# EAGLE design M223B (EAGLE 6.6.0)
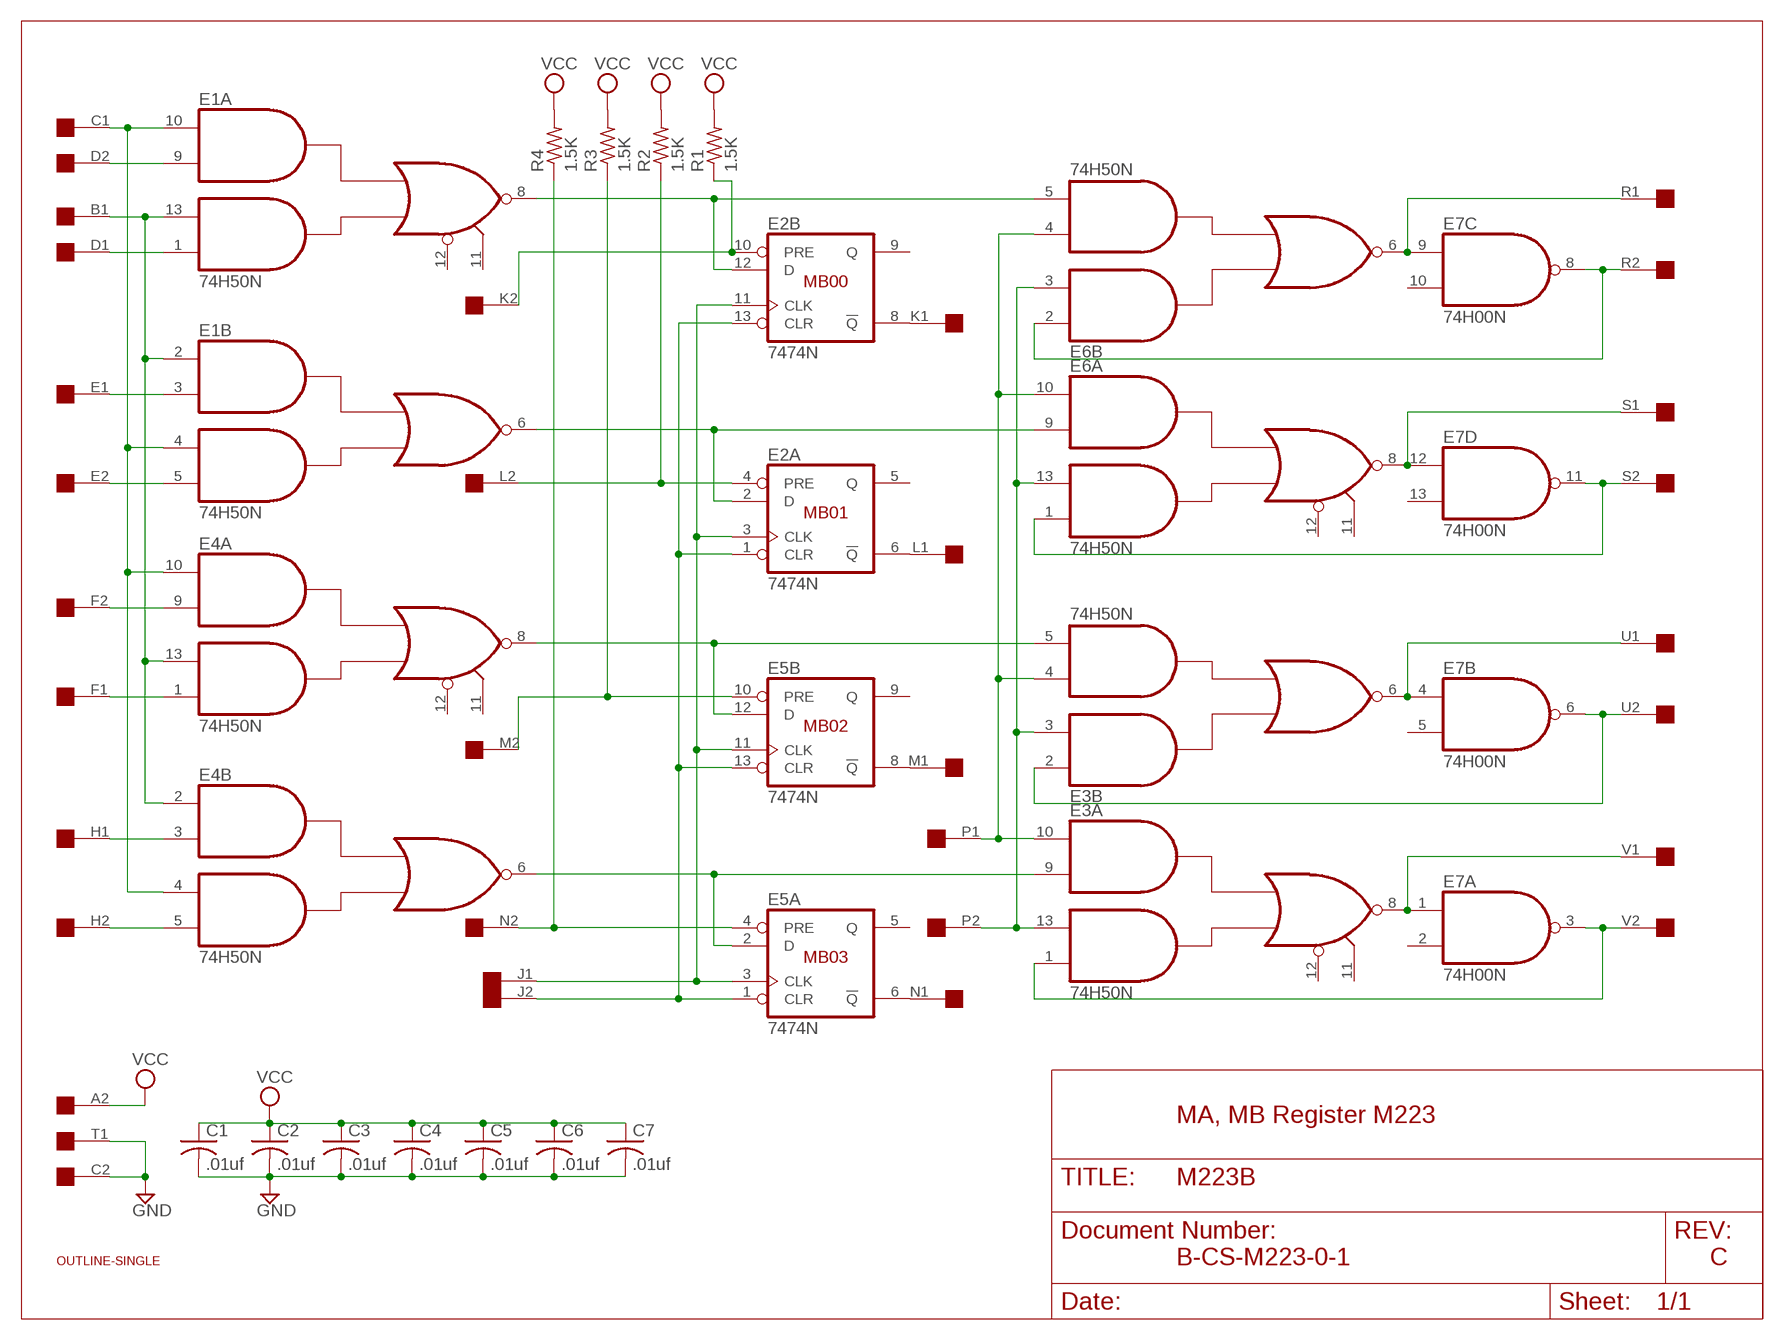
[diagram p0: schematic, sheet 1]

## Parts
C1  .01uf  C-US050-025X075  [C050-025X075]
C2  .01uf  C-US050-025X075  [C050-025X075]
C3  .01uf  C-US050-025X075  [C050-025X075]
C4  .01uf  C-US050-025X075  [C050-025X075]
C5  .01uf  C-US050-025X075  [C050-025X075]
C6  .01uf  C-US050-025X075  [C050-025X075]
C7  .01uf  C-US050-025X075  [C050-025X075]
E1  74H50N  7450N  [DIL14]
E2  7474N  74S74N  [DIL14]
E3  74H50N  7450N  [DIL14]
E4  74H50N  7450N  [DIL14]
E5  7474N  74S74N  [DIL14]
E6  74H50N  7450N  [DIL14]
E7  74H00N  7400N  [DIL14]
R1  1.5K  R-US_0207/10  [0207/10]
R2  1.5K  R-US_0207/10  [0207/10]
R3  1.5K  R-US_0207/10  [0207/10]
R4  1.5K  R-US_0207/10  [0207/10]
U$1  OUTLINE-SINGLE  [SINGLE]
U$4  SINGLE  [EDGE-CON2]

## Nets
GND [Supply]: C1.2 C2.2 C3.2 C4.2 C5.2 C6.2 C7.2 U$4.C2 U$4.T1
N$1: E1.6(B:O) E2.2(A:D) E6.9(A:I2)
N$2: E1.8(A:O) E2.12(B:D) E6.5(B:I4)
N$3: E3.8(A:O) E7.1(A:I0) U$4.V1
N$4: E1.1(A:I4) U$4.D1
N$5: E1.9(A:I2) U$4.D2
N$6: E1.2(B:I1) E1.13(A:I3) E4.2(B:I1) E4.13(A:I3) U$4.B1
N$7: E1.4(B:I3) E1.10(A:I1) E4.4(B:I3) E4.10(A:I1) U$4.C1
N$8: E1.3(B:I2) U$4.E1
N$9: E1.5(B:I4) U$4.E2
N$10: E4.1(A:I4) U$4.F1
N$11: E4.3(B:I2) U$4.H1
N$12: E4.9(A:I2) U$4.F2
N$13: E4.5(B:I4) U$4.H2
N$14: E3.5(B:I4) E4.8(A:O) E5.12(B:D)
N$15: E3.9(A:I2) E4.6(B:O) E5.2(A:D)
N$16: E3.6(B:O) E7.4(B:I0) U$4.U1
N$17: E6.8(A:O) E7.12(D:I0) U$4.S1
N$18: E6.6(B:O) E7.9(C:I0) U$4.R1
N$19: E2.8(B:!Q) U$4.K1
N$20: E2.6(A:!Q) U$4.L1
N$21: E5.8(B:!Q) U$4.M1
N$22: E5.6(A:!Q) U$4.N1
N$23: E2.3(A:CLK) E2.11(B:CLK) E5.3(A:CLK) E5.11(B:CLK) U$4.J1
N$24: E2.1(A:CLR) E2.13(B:CLR) E5.1(A:CLR) E5.13(B:CLR) U$4.J2
N$25: E2.10(B:PRE) R1.1 U$4.K2
N$26: E5.4(A:PRE) R4.1 U$4.N2
N$27: E5.10(B:PRE) R3.1 U$4.M2
N$28: E2.4(A:PRE) R2.1 U$4.L2
N$29: E3.3(B:I2) E3.13(A:I3) E6.3(B:I2) E6.13(A:I3) U$4.P2
N$30: E3.4(B:I3) E3.10(A:I1) E6.4(B:I3) E6.10(A:I1) U$4.P1
N$31: E3.1(A:I4) E7.3(A:O) U$4.V2
N$33: E3.2(B:I1) E7.6(B:O) U$4.U2
N$34: E6.1(A:I4) E7.11(D:O) U$4.S2
N$36: E6.2(B:I1) E7.8(C:O) U$4.R2
VCC [Supply]: C1.1 C2.1 C3.1 C4.1 C5.1 C6.1 C7.1 R1.2 R2.2 R3.2 R4.2 U$4.A2
Unconnected: E1.11(A:I6) E1.12(A:I5) E2.5(A:Q) E2.9(B:Q) E3.11(A:I6) E3.12(A:I5) E4.11(A:I6) E4.12(A:I5) E5.5(A:Q) E5.9(B:Q) E6.11(A:I6) E6.12(A:I5) E7.2(A:I1) E7.5(B:I1) E7.10(C:I1) E7.13(D:I1) U$4.A1 U$4.B2 U$4.T2

## Notes on the sheet
- MB00
- MB01
- MB02
- MB03
- MA, MB Register M223
- B-CS-M223-0-1 | C

## Power pins joined to a net without a drawn wire
GND: E1.7(P:GND) E2.7(P:GND) E3.7(P:GND) E4.7(P:GND) E5.7(P:GND) E6.7(P:GND) E7.7(P:GND)
VCC: E1.14(P:VCC) E2.14(P:VCC) E3.14(P:VCC) E4.14(P:VCC) E5.14(P:VCC) E6.14(P:VCC) E7.14(P:VCC)

## Library data of the parts
C1-C7 = rcl:C-US: CAPACITOR, American symbol
E1 E3 E4 E6 = dec-con:74*50: 4-2-3-2 input AND OR INVERTER gates
E2 E5 = 74xx-us:74*74: Dual D type positive edge triggered FLIP FLOP, preset and clear
E7 = 74xx-us:74*00: Quad 2-input NAND gate
R1-R4 = rcl:R-US_: RESISTOR, American symbol
U$1 = dec-con:OUTLINE-*: Board outlines for DEC boards.
U$4 = dec-con:SINGLE: Single-Height DEC board

## Net classes
1 Supply: width 0.813 mm

## Board
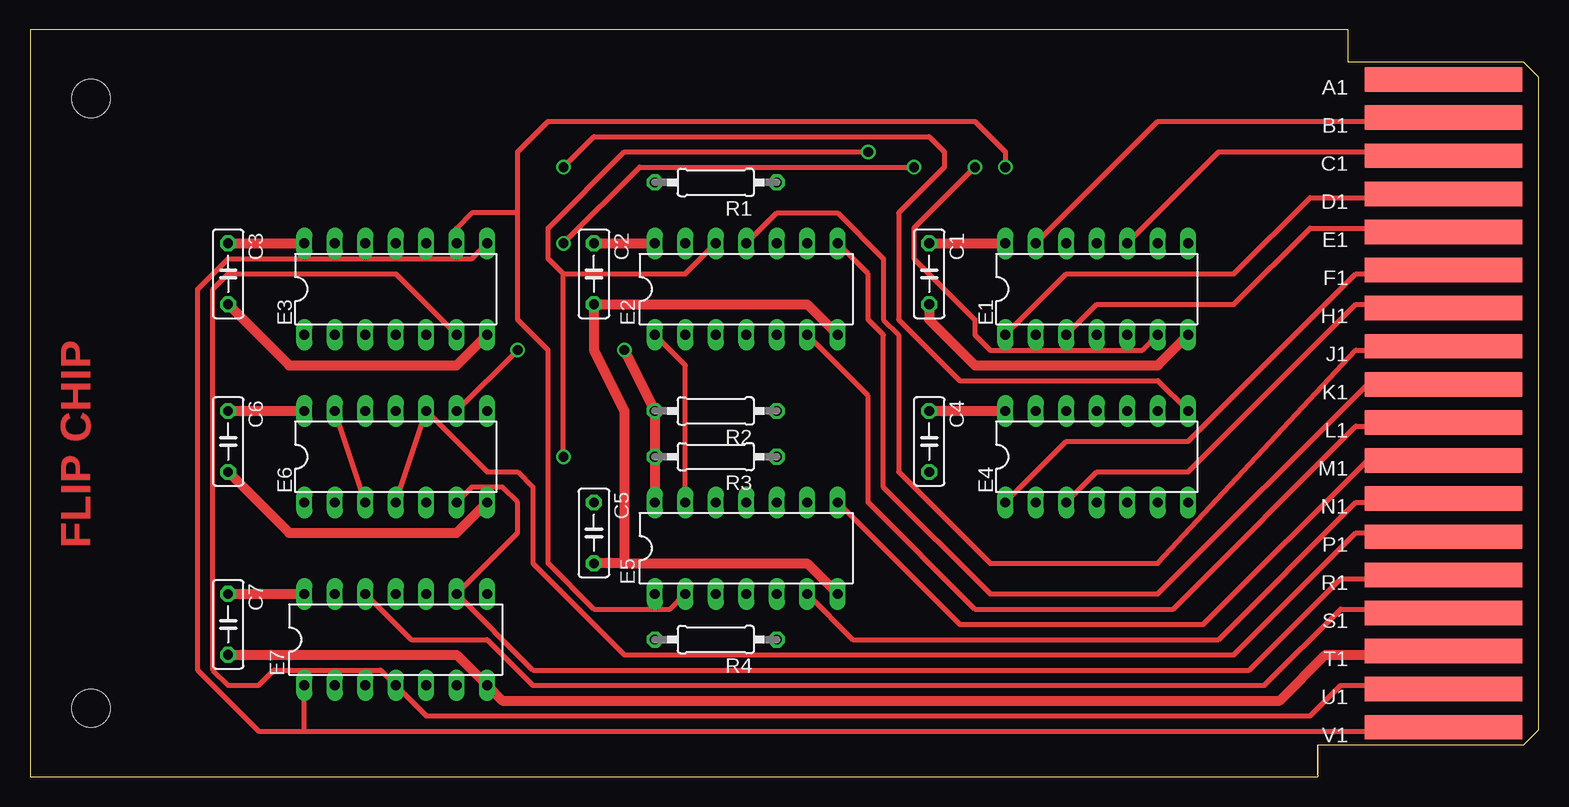
[diagram p1: board, top side]
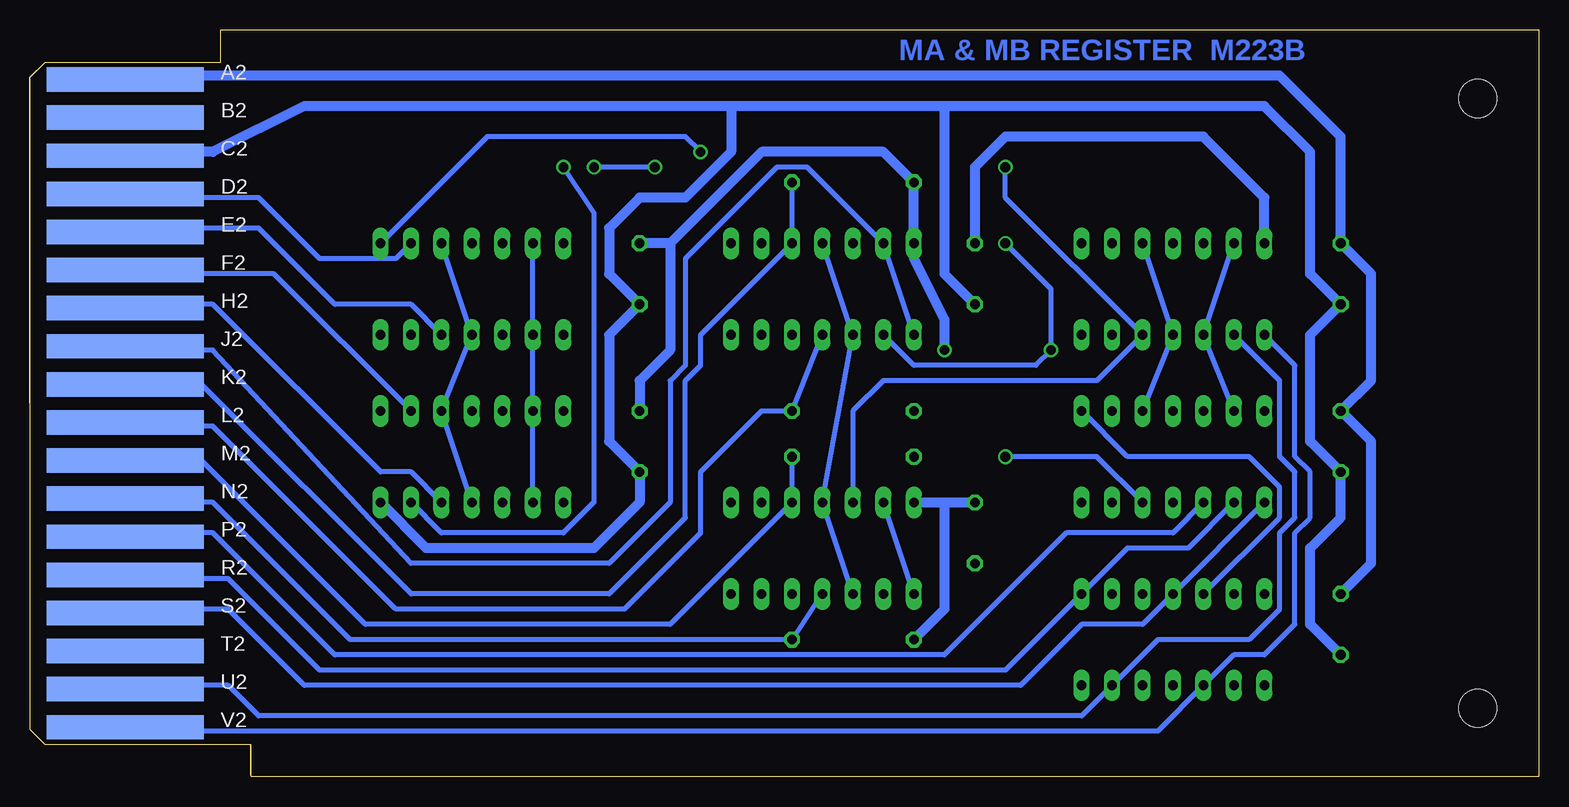
[diagram p2: board, bottom side, seen from below]

Size 125.73 x 62.23 mm. Coordinates in mm from the lower left corner, seen from the top.
Copper layers (1+16): Top 0.035mm / dielectric 1.5mm / Bottom 0.035mm
Design rules "16mils": minimum track width 16mil, minimum drill 32mil, track to track 15mil, track to pad 10mil, pad to pad 10mil, via to via 10mil, smd to smd 10mil, copper to edge 13mil, drill to drill 10mil, minimum pad ring 10mil, minimum via ring 8mil, stop-mask expansion 0mil, vias tented up to drill 0mil, thermal gap 10mil

### Footprints (pad centres in the part's own frame; a part is rotated, then mirrored left to right if it is on the bottom)
C050-025X075 = drill 0.813 octagon: 1 -2.54,0; 2 2.54,0
DIL14 = drill 0.813 long: 1 -7.62,-3.81; 2 -5.08,-3.81; 3 -2.54,-3.81; 4 0,-3.81; 5 2.54,-3.81; 6 5.08,-3.81; 7 7.62,-3.81; 8 7.62,3.81; 9 5.08,3.81; 10 2.54,3.81; 11 0,3.81; 12 -2.54,3.81; 13 -5.08,3.81; 14 -7.62,3.81
0207/10 = drill 0.813 octagon: 1 -5.08,0; 2 5.08,0
SINGLE = hole 3.175: 120.65,56.515; 120.65,5.715
EDGE-CON2 = smd 13.106 x 2.032: A1 7.938,4.128; B1 7.938,7.303; C1 7.938,10.477; D1 7.938,13.652; E1 7.938,16.828; F1 7.938,20.003; H1 7.938,23.177; J1 7.938,26.352; K1 7.938,29.527; L1 7.938,32.703; M1 7.938,35.877; N1 7.938,39.053; P1 7.938,42.227; R1 7.938,45.403; S1 7.938,48.578; T1 7.938,51.752; U1 7.938,54.928; V1 7.938,58.102 | smd 13.106 x 2.032 bottom: A2 7.938,4.128; B2 7.938,7.303; C2 7.938,10.477; D2 7.938,13.652; E2 7.938,16.828; F2 7.938,20.003; H2 7.938,23.177; J2 7.938,26.352; K2 7.938,29.527; L2 7.938,32.703; M2 7.938,35.877; N2 7.938,39.053; P2 7.938,42.227; R2 7.938,45.403; S2 7.938,48.578; T2 7.938,51.752; U2 7.938,54.928; V2 7.938,58.102

### Placement (x,y rotation side)
C1  74.93,41.91 270 top
C2  46.99,41.91 270 top
C3  16.51,41.91 270 top
C4  74.93,27.94 270 top
C5  46.99,20.32 270 top
C6  16.51,27.94 270 top
C7  16.51,12.7 270 top
E1  88.9,40.64 0 top
E2  59.69,40.64 0 top
E3  30.48,40.64 0 top
E4  88.9,26.67 0 top
E5  59.69,19.05 0 top
E6  30.48,26.67 0 top
E7  30.48,11.43 0 top
R1  57.15,49.53 180 top
R2  57.15,30.48 180 top
R3  57.15,26.67 180 top
R4  57.15,11.43 180 top
U$1  125.73,62.23 180 top
U$4  125.73,62.23 180 top
U$5  [FLIPCHIP]  0,0 0 top

### Tracks (layer width: path | path; a pad name or v marks a point on that pad's centre or on a via)
GND
  Top 0.813: 49.53,17.78 64.77,17.78 E5.7 | E2.7 64.77,39.37 C2.2 46.99,35.56 49.53,30.48 49.53,17.78 | E1.7 93.98,34.29 78.74,34.29 74.93,38.1 C1.2 | E3.7 35.56,34.29 21.59,34.29 C3.2 | U$4.T1 116.84,10.16 107.95,10.16 104.14,6.35 39.37,6.35 E7.7 35.56,10.16 C7.2 | E6.7 35.56,20.32 21.59,20.32 C6.2 | 49.53,17.78 C5.2
  Bottom 0.813: U$4.C2 117.17,51.74 116.84,52.07 110.49,52.07 102.87,55.88 67.31,55.88 | 49.53,55.88 67.31,55.88 | 49.53,55.88 49.53,41.91 C2.2 | 49.53,55.88 22.86,55.88 19.05,52.07 19.05,41.91 C3.2 19.05,36.83 19.05,27.94 C6.2 16.51,21.59 19.05,19.05 19.05,12.7 C7.2 | 67.31,55.88 67.31,52.07 71.12,48.26 74.93,48.26 77.47,45.72 77.47,41.91 C1.2 77.47,36.83 77.47,27.94 C4.2 74.93,22.86 78.74,19.05 92.71,19.05 E4.7
N$1  (via drill 0.81)
  Top 0.406: E6.9 v40.64,35.56 | v44.45,44.45 50.8,50.8 v73.66,50.8 | E1.6 92.71,35.56 80.01,35.56 78.74,36.83 78.74,38.1 73.66,43.18 73.66,45.72 v78.74,50.8
  Bottom 0.406: E2.2 52.07,34.29 41.91,34.29 v40.64,35.56 40.64,40.64 v44.45,44.45 | v73.66,50.8 v78.74,50.8
N$2  (via drill 0.81)
  Top 0.406: E2.12 54.61,41.91 44.45,41.91 | v44.45,26.67 44.45,41.91 | v69.85,52.07 49.53,52.07 43.18,45.72 43.18,43.18 44.45,41.91
  Bottom 0.406: E6.5 36.83,26.67 v44.45,26.67 | E1.8 87.63,53.34 71.12,53.34 v69.85,52.07
N$3
  Top 0.406: U$4.V1 116.84,3.81 22.86,3.81 | 22.86,3.81 E7.1 | 22.86,3.81 19.05,3.81 13.97,8.89 13.97,40.64 16.51,43.18 36.83,43.18 E3.8
N$4
  Top 0.406: U$4.D1 116.84,48.26 106.68,48.26 100.33,41.91 86.36,41.91 E1.1
N$5
  Bottom 0.406: E1.9 95.25,43.18 101.6,43.18 106.68,48.26 116.84,48.26 U$4.D2
N$6
  Top 0.406: U$4.B1 116.84,54.61 93.98,54.61 E1.13
  Bottom 0.406: E4.2 E4.13 E1.2 E1.13
N$7
  Top 0.406: U$4.C1 116.84,52.07 99.06,52.07 E1.10
  Bottom 0.406: E4.4 E4.10 E1.4 E1.10
N$8
  Top 0.406: U$4.E1 116.84,45.72 106.68,45.72 100.33,39.37 88.9,39.37 E1.3
N$9
  Bottom 0.406: E1.5 93.98,39.37 100.33,39.37 106.68,45.72 116.84,45.72 U$4.E2
N$10
  Top 0.406: E4.1 86.36,27.94 96.52,27.94 110.49,41.91 116.84,41.91 U$4.F1
N$11
  Top 0.406: U$4.H1 116.84,39.37 110.49,39.37 96.52,25.4 88.9,25.4 E4.3
N$12
  Bottom 0.406: E4.9 105.41,41.91 116.84,41.91 U$4.F2
N$13
  Bottom 0.406: U$4.H2 117.17,39.04 116.84,39.37 110.49,39.37 96.52,25.4 93.98,25.4 E4.5
N$14  (via drill 0.81)
  Top 0.406: E4.8 93.98,33.02 77.47,33.02 72.39,38.1 72.39,46.99 76.2,50.8 76.2,52.07 74.93,53.34 46.99,53.34 v44.45,50.8
  Bottom 0.406: E5.12 57.15,30.48 54.61,33.02 36.83,33.02 E3.5 44.45,48.26 v44.45,50.8
N$15  (via drill 0.81)
  Top 0.406: E3.9 35.56,45.72 36.83,46.99 40.64,46.99 | 40.64,46.99 40.64,38.1 43.18,35.56 43.18,17.78 46.99,13.97 53.34,13.97 E5.2 | v81.28,50.8 81.28,52.07 78.74,54.61 43.18,54.61 40.64,52.07 40.64,46.99
  Bottom 0.406: E4.6 91.44,20.32 81.28,20.32 78.74,22.86 78.74,46.99 v81.28,50.8
N$16
  Top 0.406: U$4.U1 116.84,7.62 109.22,7.62 106.68,5.08 33.02,5.08 E7.4 29.21,8.89 20.32,8.89 19.05,7.62 16.51,7.62 15.24,8.89 15.24,40.64 16.51,41.91 30.48,41.91 E3.6
N$17
  Top 0.406: U$4.S1 116.84,13.97 109.22,13.97 102.87,7.62 41.91,7.62 38.1,11.43 31.75,11.43 E7.12
  Bottom 0.406: E7.12 21.59,21.59 21.59,24.13 24.13,26.67 34.29,26.67 E6.8
N$18
  Top 0.406: U$4.R1 116.84,16.51 109.22,16.51 101.6,8.89 41.91,8.89 E7.9 40.64,20.32 40.64,22.86 39.37,24.13 36.83,24.13 E6.6
N$19
  Top 0.406: E2.8 69.85,41.91 69.85,38.1 71.12,36.83 71.12,24.13 80.01,15.24 93.98,15.24 111.76,33.02 116.84,33.02 U$4.K1
N$20
  Top 0.406: E2.6 69.85,31.75 69.85,22.86 78.74,13.97 95.25,13.97 110.49,29.21 116.84,29.21 U$4.L1
N$21
  Top 0.406: U$4.M1 116.84,26.67 111.76,26.67 97.79,12.7 77.47,12.7 E5.8
N$22
  Top 0.406: U$4.N1 116.84,22.86 110.49,22.86 99.06,11.43 68.58,11.43 E5.6
N$23
  Top 0.406: E2.11 62.23,46.99 67.31,46.99 71.12,43.18 71.12,38.1 72.39,36.83 72.39,25.4 80.01,17.78 93.98,17.78 110.49,35.56 116.84,35.56 U$4.J1
  Bottom 0.406: E5.3 E5.11 E2.3 E2.11
N$24
  Top 0.406: E2.1 54.61,34.29 E5.13
  Bottom 0.406: E5.1 E5.13 | E2.1 E2.13 60.96,50.8 63.5,50.8 71.12,43.18 71.12,34.29 72.39,33.02 72.39,22.86 77.47,17.78 93.98,17.78 110.49,35.56 111.76,35.56 116.84,35.56 117.17,35.89 U$4.J2
N$25
  Bottom 0.406: R1.1 E2.10 69.85,36.83 69.85,34.29 71.12,33.02 71.12,21.59 77.47,15.24 93.98,15.24 111.76,33.02 116.84,33.02 117.14,32.72 U$4.K2
N$26
  Bottom 0.406: E5.4 R4.1 99.06,11.43 110.49,22.86 116.84,22.86 117.17,23.19 U$4.N2
N$27
  Bottom 0.406: R3.1 E5.10 72.39,12.7 97.79,12.7 111.76,26.67 116.84,26.67 117.17,26.34 U$4.M2
N$28
  Bottom 0.406: E2.4 R2.1 64.77,30.48 69.85,25.4 69.85,20.32 76.2,13.97 95.25,13.97 110.49,29.21 115.57,29.21 115.9,29.54 U$4.L2
N$29
  Top 0.406: E6.3 E6.13
  Bottom 0.406: U$4.P2 117.17,19.99 116.84,20.32 110.49,20.32 100.33,10.16 49.53,10.16 39.37,20.32 30.48,20.32 E6.3 | E3.13 E3.3 E6.13
N$30
  Top 0.406: E6.4 E6.10 38.1,25.4 40.64,25.4 41.91,24.13 41.91,17.78 49.53,10.16 100.33,10.16 110.49,20.32 116.84,20.32 U$4.P1
  Bottom 0.406: E3.10 E3.4 E6.10
N$31
  Bottom 0.406: U$4.V2 117.23,4.2 116.84,3.81 31.75,3.81 E7.3 25.4,10.16 22.86,10.16 20.32,12.7 20.32,20.32 19.05,21.59 19.05,25.4 20.32,26.67 20.32,34.29 E3.1
N$33
  Bottom 0.406: U$4.U2 117.2,7.26 116.84,7.62 109.22,7.62 106.68,5.08 38.1,5.08 E7.6 31.75,11.43 24.13,11.43 21.59,13.97 21.59,20.32 20.32,21.59 20.32,25.4 21.59,26.67 21.59,33.02 E3.2
N$34
  Bottom 0.406: U$4.S2 117.14,13.66 116.84,13.97 109.22,13.97 102.87,7.62 43.18,7.62 38.1,12.7 33.02,12.7 E7.11 E6.1
N$36
  Bottom 0.406: U$4.R2 117.17,16.84 116.84,16.51 109.22,16.51 101.6,8.89 44.45,8.89 E7.8 34.29,19.05 29.21,19.05 E6.2
VCC  (via drill 0.81)
  Top 0.813: C7.1 E7.14 | C6.1 E6.14 | C3.1 E3.14 | C2.1 E2.14 | C1.1 E1.14 | C4.1 E4.14 | E5.14 R3.2 R2.2 v49.53,35.56
  Bottom 0.813: 49.53,22.86 C5.1 | R4.2 49.53,13.97 49.53,22.86 | E5.14 49.53,22.86 | U$4.A2 116.84,58.42 21.59,58.42 16.51,53.34 C3.1 13.97,41.91 13.97,33.02 C6.1 13.97,27.94 13.97,17.78 C7.1 | 72.39,44.45 64.77,52.07 54.61,52.07 R1.2 E2.14 52.07,43.18 49.53,38.1 v49.53,35.56 | 72.39,44.45 72.39,35.56 74.93,33.02 C4.1 | E3.14 22.86,48.26 27.94,53.34 44.45,53.34 46.99,50.8 C2.1 | 72.39,44.45 C1.1

### Text on the board
Bottom: MA & MB REGISTER M223B